# EAGLE design untitled (EAGLE 9.5.0)
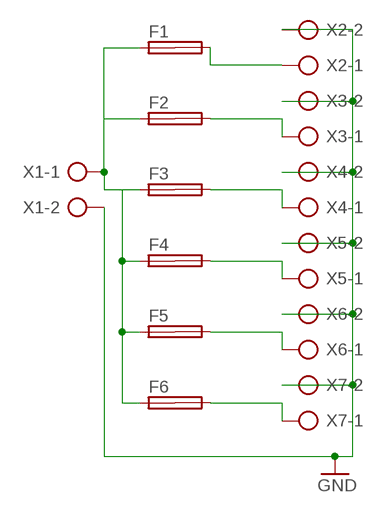
[diagram p0: schematic, sheet 1]

## Parts
F1  SHK20Q  [SHK20Q]
F2  SHK20Q  [SHK20Q]
F3  SHK20Q  [SHK20Q]
F4  SHK20Q  [SHK20Q]
F5  SHK20Q  [SHK20Q]
F6  SHK20Q  [SHK20Q]
X1  AK500/2-H  [AK500/2-H]
X2  AK500/2-H  [AK500/2-H]
X3  AK500/2-H  [AK500/2-H]
X4  AK500/2-H  [AK500/2-H]
X5  AK500/2-H  [AK500/2-H]
X6  AK500/2-H  [AK500/2-H]
X7  AK500/2-H  [AK500/2-H]

## Nets
GND: X1.2 X2.2 X3.2 X4.2 X5.2 X6.2 X7.2
N$1: F1.1A F2.1A F3.1A F4.1A F5.1A F6.1A X1.1
N$2: F1.2A X2.1
N$3: F2.2A X3.1
N$4: F3.2A X4.1
N$5: F4.2A X5.1
N$6: F5.2A X6.1
N$7: F6.2A X7.1
Unconnected: F1.1B F1.2B F2.1B F2.2B F3.1B F3.2B F4.1B F4.2B F5.1B F5.2B F6.1B F6.2B

## Library data of the parts
F1-F6 = fuse:SHK20Q: FUSE HOLDER 5 x 20 mm, SH contact, E1207 Buerklin 64G6061; OC_FARNELL: unknown; OC_NEWARK: unknown
X1-X7 = con-ptr500:AK500/2-H: CONNECTOR Aug. 2004 / PTR Meßtechnik: Die Bezeichnung der Serie AK505 wurde geändert. Es handelt sich hierbei um AK500 in horizontaler Ausführung.; OC_FARNELL: unknown; OC_NEWARK: unknown

## Board
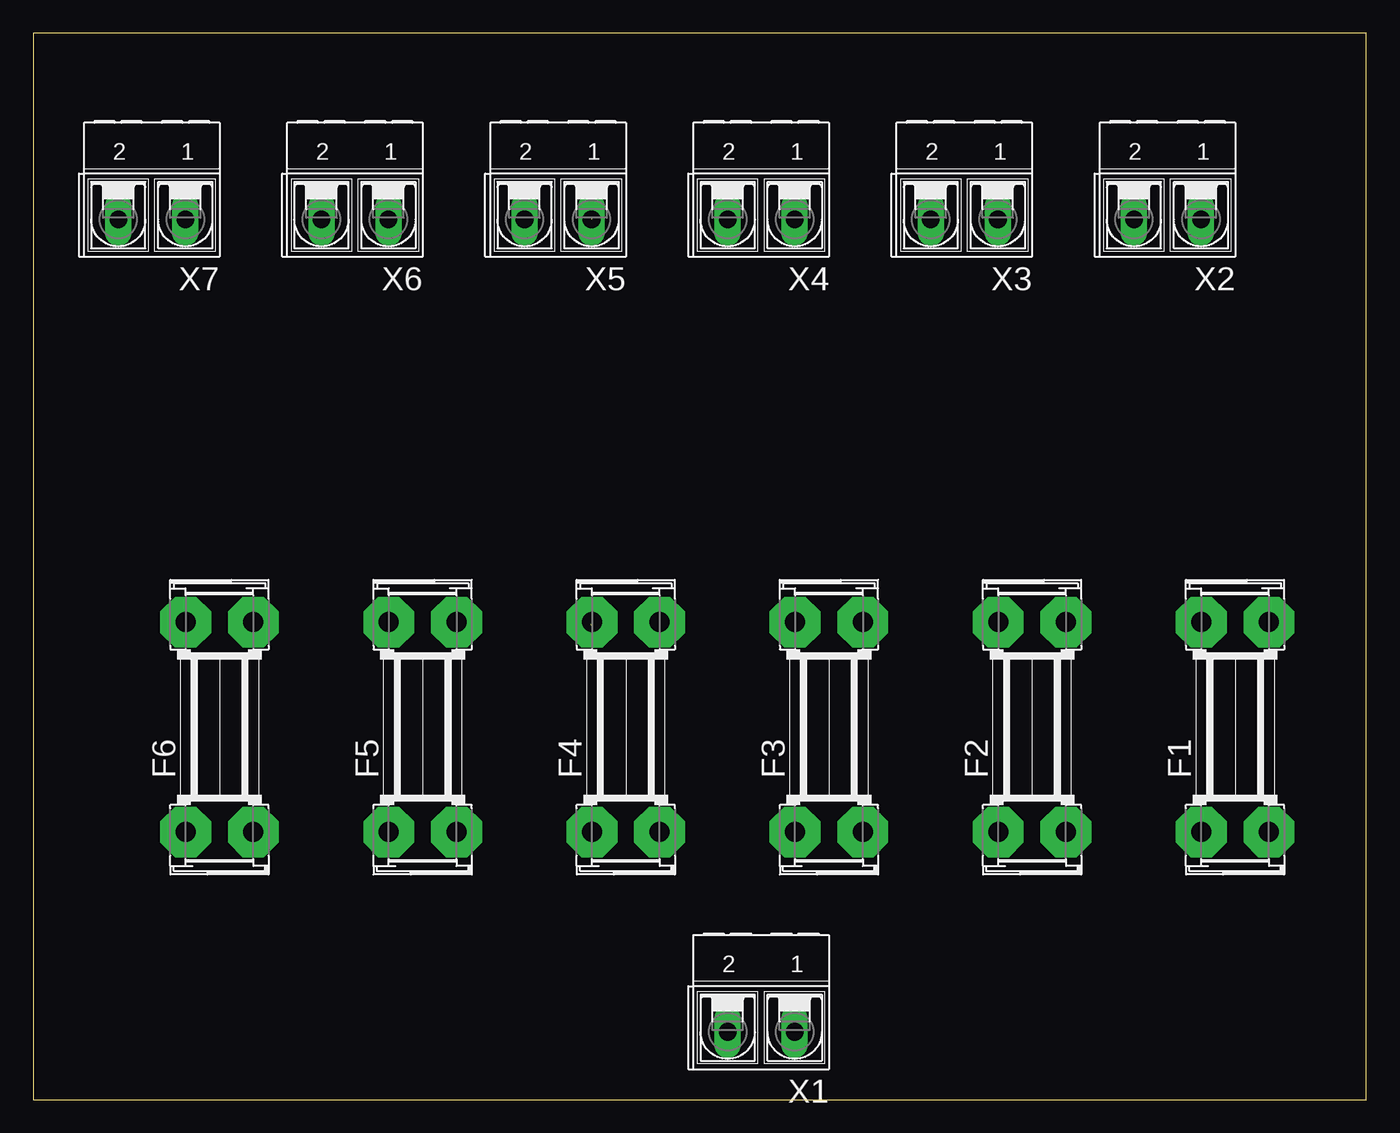
[diagram p1: board, top side]
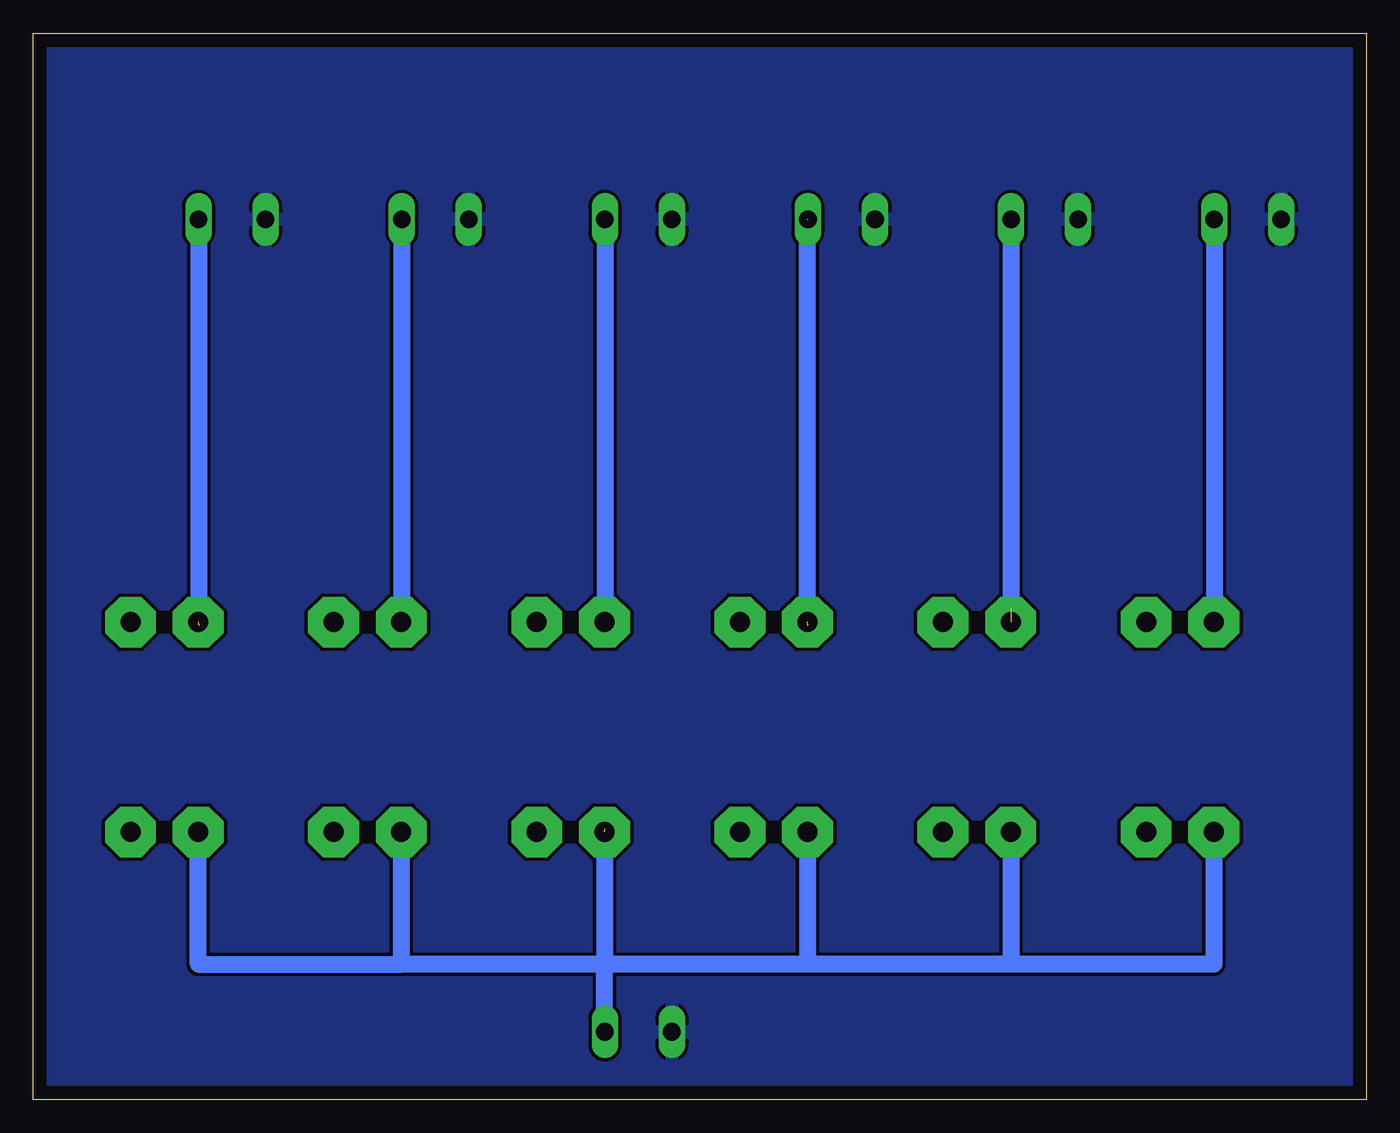
[diagram p2: board, bottom side, seen from below]

Size 100 x 80 mm. Coordinates in mm from the lower left corner, seen from the top.
Outline: 0,0 100,0 100,80 0,80 0,0
Copper layers (1*16): Top 0.035mm / dielectric 1.5mm / Bottom 0.035mm
Design rules "default": minimum track width 6mil, minimum drill 0.35mm, track to track 6mil, track to pad 6mil, pad to pad 6mil, via to via 6mil, smd to smd 6mil, copper to edge 40mil, drill to drill 6mil, minimum pad ring 10mil, minimum via ring 8mil, stop-mask expansion 4mil, vias tented up to drill 0mil, thermal gap 10mil

### Footprints (pad centres in the part's own frame; a part is rotated, then mirrored left to right if it is on the bottom)
SHK20Q = drill 1.5 pad 3.81 octagon: 1A -7.874,2.54; 1B -7.874,-2.54; 2A 7.874,2.54; 2B 7.874,-2.54
AK500/2-H = drill 1.321 long: 1 -2.515,0; 2 2.515,0

### Placement (x,y rotation side)
F1  90.17,27.94 90 top
F2  74.93,27.94 90 top
F3  59.69,27.94 90 top
F4  44.45,27.94 90 top
F5  29.21,27.94 90 top
F6  13.97,27.94 90 top
X1  54.61,5.08 180 top
X2  85.09,66.04 180 top
X3  69.85,66.04 180 top
X4  54.61,66.04 180 top
X5  39.37,66.04 180 top
X6  24.13,66.04 180 top
X7  8.89,66.04 180 top

### Tracks (layer width: path | path; a pad name or v marks a point on that pad's centre or on a via)
GND
  pour Bottom (isolate 0.254): 0,80.01 100.33,80.01 100.33,78.74 100.33,0 0,0
N$1  (1 unrouted)
  Bottom 0.152: 57.12,20.3 57.15,20.32
  Bottom 1.27: F6.1A 11.43,10.16 26.67,10.16 | 72.39,10.16 87.63,10.16 F1.1A | 57.15,10.16 72.39,10.16 | 41.91,10.16 57.15,10.16 | 26.67,10.16 41.91,10.16 | F5.1A 26.67,10.16 | F4.1A 41.91,10.16 | F3.1A 57.15,10.16 | F2.1A 72.39,10.16 | X1.1 57.15,5.11 57.15,10.16
N$2  (1 unrouted)
  Bottom 1.016: 87.61,35.56 88.9,35.56
  Bottom 1.27: X2.1 87.61,35.84 F1.2A
N$3
  Bottom 1.016: 72.36,35.81 F2.2A
  Bottom 1.27: X3.1 72.36,35.81
N$4
  Bottom 1.016: 57.12,35.81 F3.2A
  Bottom 1.27: X4.1 57.12,35.81
N$5  (2 unrouted)
  Bottom 1.016: 41.88,35.56 41.91,35.56
  Bottom 1.27: F4.2A 41.91,66.04
N$6  (1 unrouted)
  Bottom 1.016: X6.1 26.67,66.04
  Bottom 1.27: 26.67,66.04 26.67,36.83
N$7
  Bottom 1.016: 11.4,35.81 F6.2A
  Bottom 1.27: X7.1 11.4,35.81